# EAGLE schematic RAM Board trex (EAGLE 6.6.0)
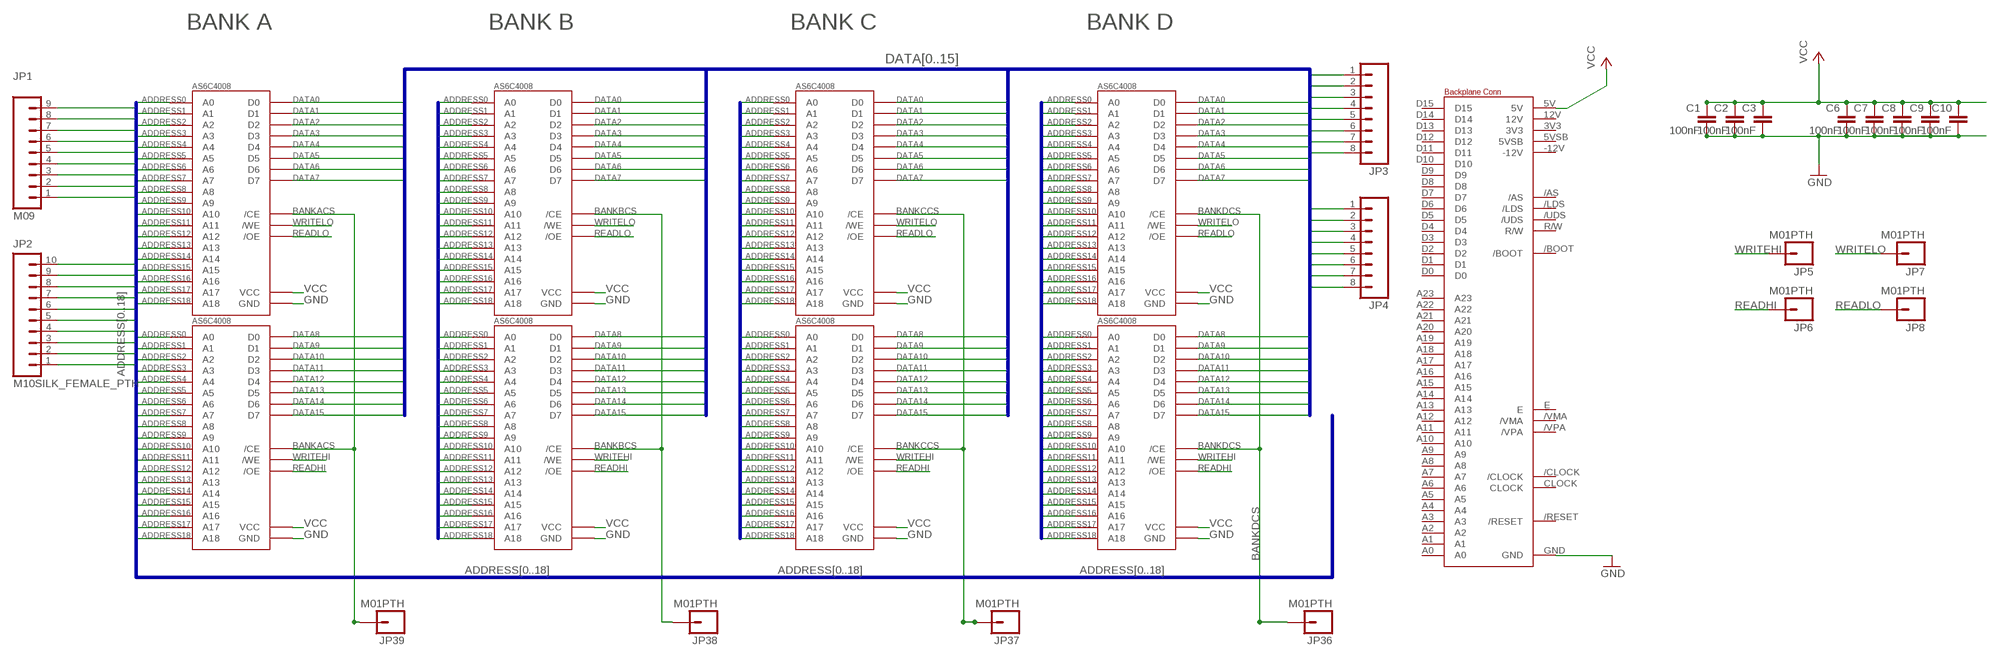
[diagram p0: schematic, sheet 1]

## Parts
AH  AS6C4008  [DIL32]
AL  AS6C4008  [DIL32]
BH  AS6C4008  [DIL32]
BL  AS6C4008  [DIL32]
C1  100nF  CAPPTH  [CAP-PTH-SMALL]
C2  100nF  CAPPTH  [CAP-PTH-SMALL]
C3  100nF  CAPPTH  [CAP-PTH-SMALL]
C6  100nF  CAPPTH  [CAP-PTH-SMALL]
C7  100nF  CAPPTH  [CAP-PTH-SMALL]
C8  100nF  CAPPTH  [CAP-PTH-SMALL]
C9  100nF  CAPPTH  [CAP-PTH-SMALL]
C10  100nF  CAPPTH  [CAP-PTH-SMALL]
CH  AS6C4008  [DIL32]
CL  AS6C4008  [DIL32]
DH  AS6C4008  [DIL32]
DL  AS6C4008  [DIL32]
JP1  M09  [1X09]
JP2  M10SILK_FEMALE_PTH  [1X10]
JP3  M08  [1X08_ROUND]
JP4  M08  [1X08_ROUND]
JP5  M01PTH  [1X01]
JP6  M01PTH  [1X01]
JP7  M01PTH  [1X01]
JP8  M01PTH  [1X01]
JP36  M01PTH  [1X01]
JP37  M01PTH  [1X01]
JP38  M01PTH  [1X01]
JP39  M01PTH  [1X01]
U$1  BACKPLANECONN  [BLANKBOARD]

## Nets
ADDRESS0: AH.12(A0) AL.12(A0) BH.12(A0) BL.12(A0) CH.12(A0) CL.12(A0) DH.12(A0) DL.12(A0) JP1.9
ADDRESS1: AH.11(A1) AL.11(A1) BH.11(A1) BL.11(A1) CH.11(A1) CL.11(A1) DH.11(A1) DL.11(A1) JP1.8
ADDRESS2: AH.10(A2) AL.10(A2) BH.10(A2) BL.10(A2) CH.10(A2) CL.10(A2) DH.10(A2) DL.10(A2) JP1.7
ADDRESS3: AH.9(A3) AL.9(A3) BH.9(A3) BL.9(A3) CH.9(A3) CL.9(A3) DH.9(A3) DL.9(A3) JP1.6
ADDRESS4: AH.8(A4) AL.8(A4) BH.8(A4) BL.8(A4) CH.8(A4) CL.8(A4) DH.8(A4) DL.8(A4) JP1.5
ADDRESS5: AH.7(A5) AL.7(A5) BH.7(A5) BL.7(A5) CH.7(A5) CL.7(A5) DH.7(A5) DL.7(A5) JP1.4
ADDRESS6: AH.6(A6) AL.6(A6) BH.6(A6) BL.6(A6) CH.6(A6) CL.6(A6) DH.6(A6) DL.6(A6) JP1.3
ADDRESS7: AH.5(A7) AL.5(A7) BH.5(A7) BL.5(A7) CH.5(A7) CL.5(A7) DH.5(A7) DL.5(A7) JP1.2
ADDRESS8: AH.27(A8) AL.27(A8) BH.27(A8) BL.27(A8) CH.27(A8) CL.27(A8) DH.27(A8) DL.27(A8) JP1.1
ADDRESS9: AH.26(A9) AL.26(A9) BH.26(A9) BL.26(A9) CH.26(A9) CL.26(A9) DH.26(A9) DL.26(A9) JP2.10
ADDRESS10: AH.23(A10) AL.23(A10) BH.23(A10) BL.23(A10) CH.23(A10) CL.23(A10) DH.23(A10) DL.23(A10) JP2.9
ADDRESS11: AH.25(A11) AL.25(A11) BH.25(A11) BL.25(A11) CH.25(A11) CL.25(A11) DH.25(A11) DL.25(A11) JP2.8
ADDRESS12: AH.4(A12) AL.4(A12) BH.4(A12) BL.4(A12) CH.4(A12) CL.4(A12) DH.4(A12) DL.4(A12) JP2.7
ADDRESS13: AH.28(A13) AL.28(A13) BH.28(A13) BL.28(A13) CH.28(A13) CL.28(A13) DH.28(A13) DL.28(A13) JP2.6
ADDRESS14: AH.3(A14) AL.3(A14) BH.3(A14) BL.3(A14) CH.3(A14) CL.3(A14) DH.3(A14) DL.3(A14) JP2.5
ADDRESS15: AH.31(A15) AL.31(A15) BH.31(A15) BL.31(A15) CH.31(A15) CL.31(A15) DH.31(A15) DL.31(A15) JP2.4
ADDRESS16: AH.2(A16) AL.2(A16) BH.2(A16) BL.2(A16) CH.2(A16) CL.2(A16) DH.2(A16) DL.2(A16) JP2.3
ADDRESS17: AH.30(A17) AL.30(A17) BH.30(A17) BL.30(A17) CH.30(A17) CL.30(A17) DH.30(A17) DL.30(A17) JP2.2
ADDRESS18: AH.1(A18) AL.1(A18) BH.1(A18) BL.1(A18) CH.1(A18) CL.1(A18) DH.1(A18) DL.1(A18) JP2.1
BANKACS: AH.22(/CE) AL.22(/CE) JP39.1
BANKBCS: BH.22(/CE) BL.22(/CE) JP38.1
BANKCCS: CH.22(/CE) CL.22(/CE) JP37.1
BANKDCS: DH.22(/CE) DL.22(/CE) JP36.1
DATA0: AL.13(D0) BL.13(D0) CL.13(D0) DL.13(D0) JP3.1
DATA1: AL.14(D1) BL.14(D1) CL.14(D1) DL.14(D1) JP3.2
DATA2: AL.15(D2) BL.15(D2) CL.15(D2) DL.15(D2) JP3.3
DATA3: AL.17(D3) BL.17(D3) CL.17(D3) DL.17(D3) JP3.4
DATA4: AL.18(D4) BL.18(D4) CL.18(D4) DL.18(D4) JP3.5
DATA5: AL.19(D5) BL.19(D5) CL.19(D5) DL.19(D5) JP3.6
DATA6: AL.20(D6) BL.20(D6) CL.20(D6) DL.20(D6) JP3.7
DATA7: AL.21(D7) BL.21(D7) CL.21(D7) DL.21(D7) JP3.8
DATA8: AH.13(D0) BH.13(D0) CH.13(D0) DH.13(D0) JP4.1
DATA9: AH.14(D1) BH.14(D1) CH.14(D1) DH.14(D1) JP4.2
DATA10: AH.15(D2) BH.15(D2) CH.15(D2) DH.15(D2) JP4.3
DATA11: AH.17(D3) BH.17(D3) CH.17(D3) DH.17(D3) JP4.4
DATA12: AH.18(D4) BH.18(D4) CH.18(D4) DH.18(D4) JP4.5
DATA13: AH.19(D5) BH.19(D5) CH.19(D5) DH.19(D5) JP4.6
DATA14: AH.20(D6) BH.20(D6) CH.20(D6) DH.20(D6) JP4.7
DATA15: AH.21(D7) BH.21(D7) CH.21(D7) DH.21(D7) JP4.8
GND: AH.16(GND) AL.16(GND) BH.16(GND) BL.16(GND) C1.2 C2.2 C3.2 C6.2 C7.2 C8.2 C9.2 C10.2 CH.16(GND) CL.16(GND) DH.16(GND) DL.16(GND) U$1.GND
READHI: AH.24(/OE) BH.24(/OE) CH.24(/OE) DH.24(/OE) JP6.1
READLO: AL.24(/OE) BL.24(/OE) CL.24(/OE) DL.24(/OE) JP8.1
VCC: AH.32(VCC) AL.32(VCC) BH.32(VCC) BL.32(VCC) C1.1 C2.1 C3.1 C6.1 C7.1 C8.1 C9.1 C10.1 CH.32(VCC) CL.32(VCC) DH.32(VCC) DL.32(VCC) U$1.5V
WRITEHI: AH.29(/WE) BH.29(/WE) CH.29(/WE) DH.29(/WE) JP5.1
WRITELO: AL.29(/WE) BL.29(/WE) CL.29(/WE) DL.29(/WE) JP7.1
Unconnected: U$1.3V3 U$1.5VSB U$1.12V U$1.-12V U$1./AS U$1./BOOT U$1./CLOCK U$1./LDS U$1./RESET U$1./UDS U$1./VMA U$1./VPA U$1.A0 U$1.A1 U$1.A2 U$1.A3 U$1.A4 U$1.A5 U$1.A6 U$1.A7 U$1.A8 U$1.A9 U$1.A10 U$1.A11 U$1.A12 U$1.A13 U$1.A14 U$1.A15 U$1.A16 U$1.A17 U$1.A18 U$1.A19 U$1.A20 U$1.A21 U$1.A22 U$1.A23 U$1.CLOCK U$1.D0 U$1.D1 U$1.D2 U$1.D3 U$1.D4 U$1.D5 U$1.D6 U$1.D7 U$1.D8 U$1.D9 U$1.D10 U$1.D11 U$1.D12 U$1.D13 U$1.D14 U$1.D15 U$1.E U$1.R/W

## Buses
ADDRESS[0..18]
DATA[0..15]

## Notes on the sheet
- BANK A | BANK B | BANK C | BANK D

## Library data of the parts
AH AL BH BL CH CL DH DL = Benchoff:AS6C4008
C1-C3 C6-C10 = SparkFun-Capacitors:CAP: Capacitor Standard 0603 ceramic capacitor, and 0.1" leaded capacitor.
JP1 = SparkFun-Connectors:M09: Header 9 Standard 9-pin 0.1" header. Use with straight break away headers (SKU : PRT-00116), right angle break away headers (PRT-00553), swiss pins (PRT-00743), machine pins (PRT-00117), and female headers (PRT-00115).
JP2 = SparkFun-Connectors:M10: Header 10 Standard 10-pin 0.1" header. Use with straight break away headers (SKU : PRT-00116), right angle break away headers (PRT-00553), swiss pins (PRT-00743), machine pins (PRT-00117), and female headers (PRT-00115).; PROD_ID: CONN-11563
JP3 JP4 = SparkFun-Connectors:M08: Header 8 Standard 8-pin 0.1" header. Use with straight break away headers (SKU : PRT-00116), right angle break away headers (PRT-00553), swiss pins (PRT-00743), machine pins (PRT-00117), and female headers (PRT-00115).
JP5-JP8 JP36-JP39 = SparkFun-Connectors:M01: Header 1 Standard 1-pin 0.1" header. Use with straight break away headers (SKU : PRT-00116), right angle break away headers (PRT-00553), swiss pins (PRT-00743), machine pins (PRT-00117), and female headers (PRT-00115).
U$1 = Benchoff2:BACKPLANECONN: Backplane Connector